# EAGLE design rfid (EAGLE 6.5.0)
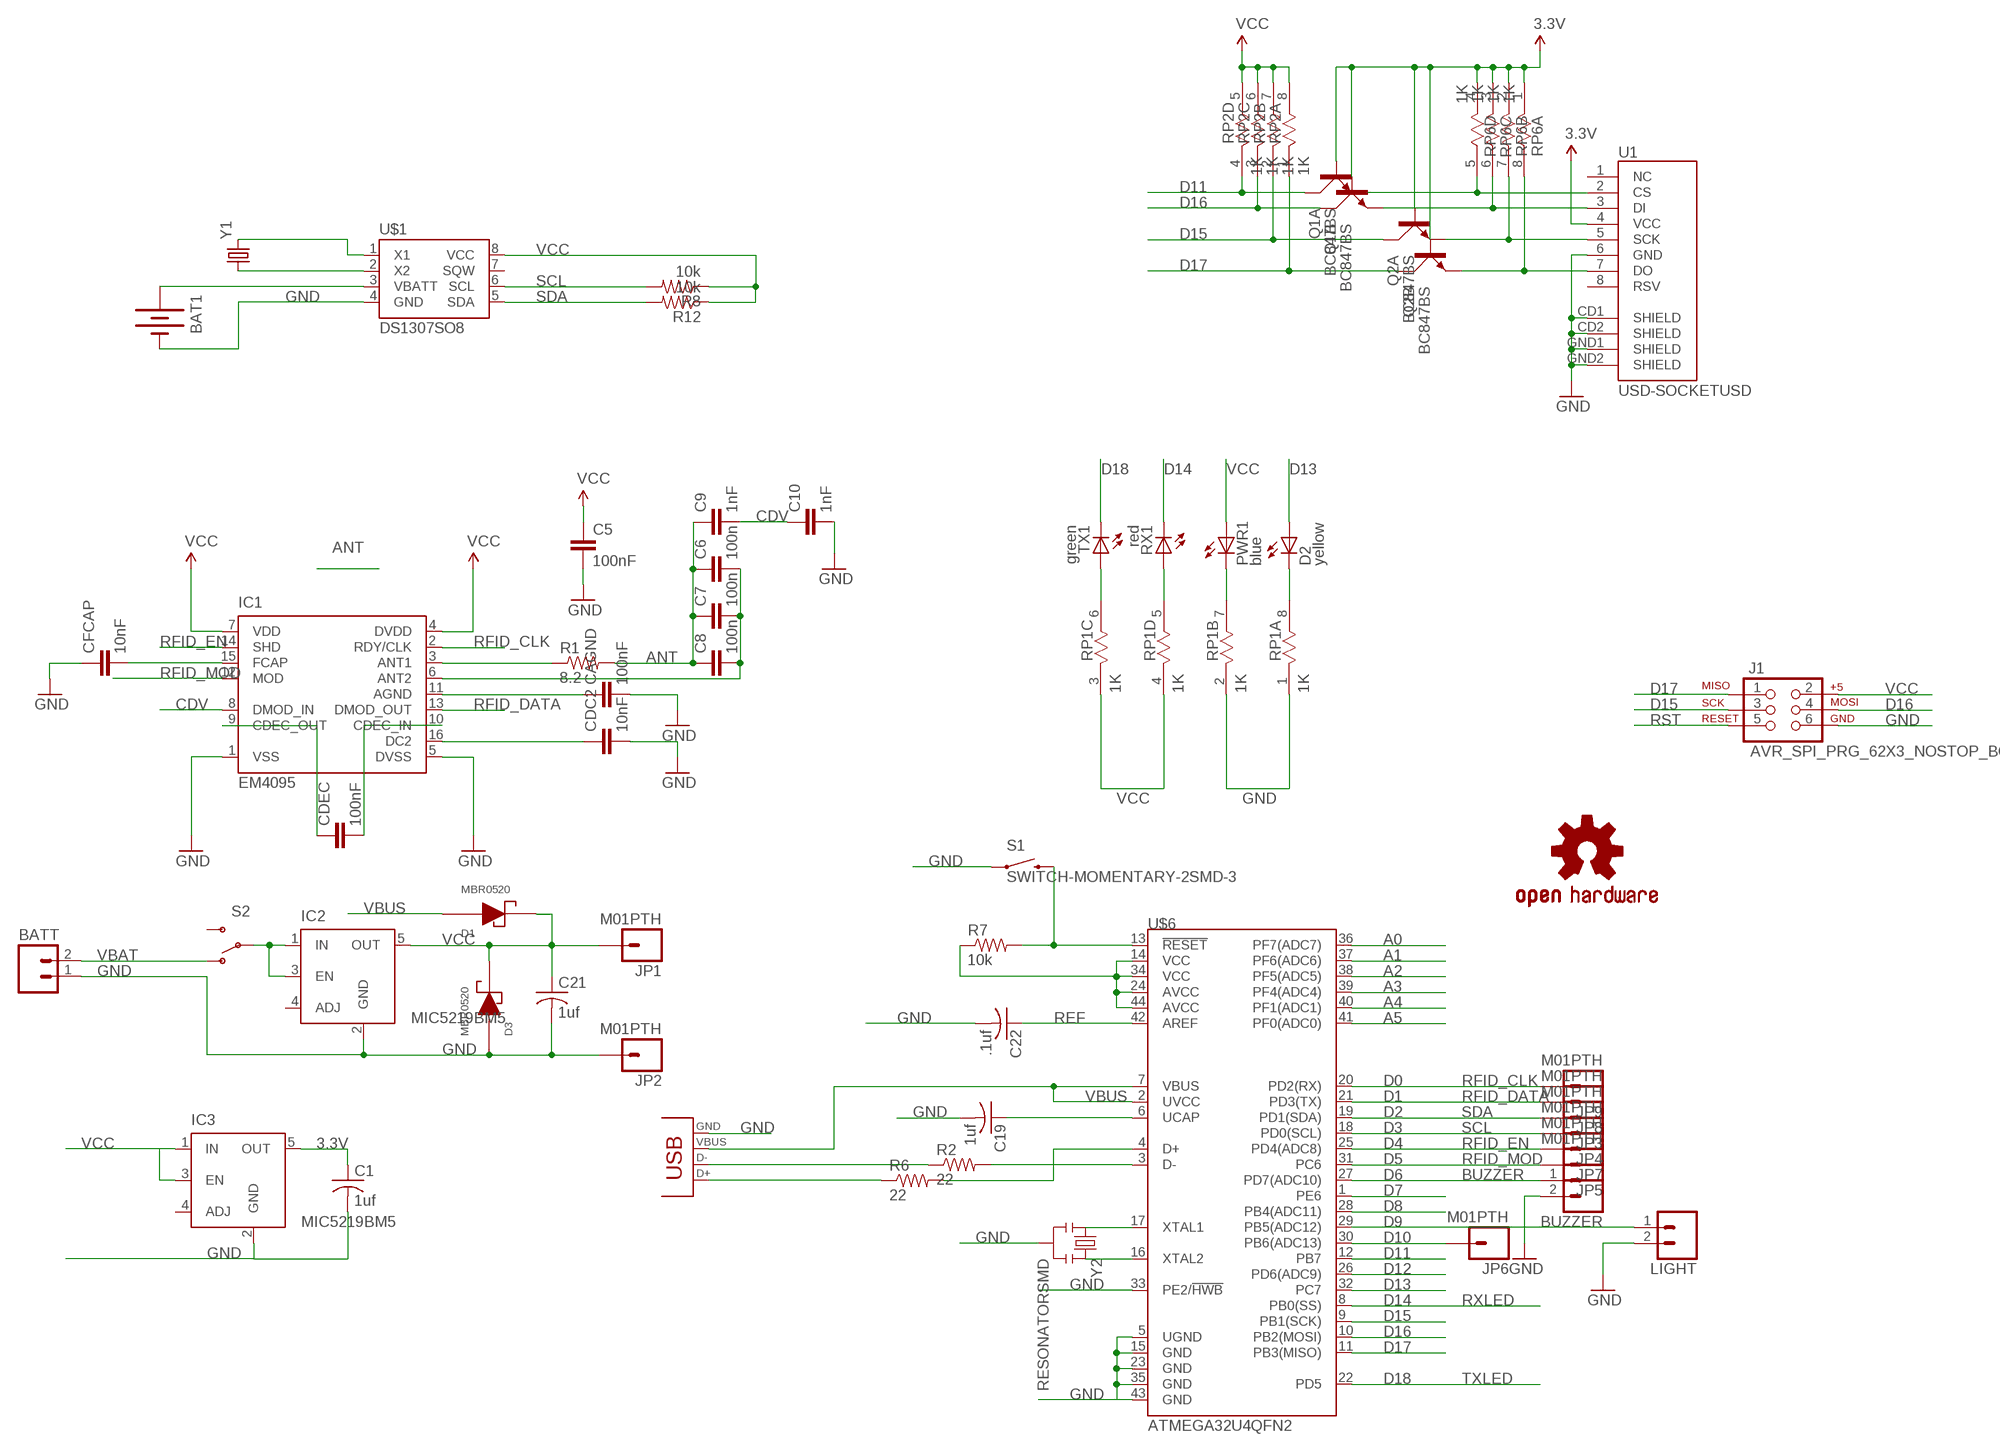
[diagram p0: schematic, sheet 1]

## Parts
BAT1  BATTERY12MM  [BATTCON_12MM]
BATT  M02PTH  [1X02]
BUZZER  M02PTH  [1X02]
C1  1uf  C-USC0603  [C0603]
C5  100nF  CAP0805  [0805]
C6  100n  CAP0805  [0805]
C7  100n  CAP0805  [0805]
C8  100n  CAP0805  [0805]
C9  1nF  CAP0805  [0805]
C10  1nF  CAP0805  [0805]
C19  1uf  C-USC0603  [C0603]
C21  1uf  C-USC0603  [C0603]
C22  .1uf  C-USC0603  [C0603]
CAGND  100nF  CAP0805  [0805]
CDC2  10nF  CAP0805  [0805]
CDEC  100nF  CAP0805  [0805]
CFCAP  10nF  CAP0805  [0805]
D1  MBR0520  [SOD-123]
D2  yellow  LED3MM  [LED3MM]
D3  MBR0520  [SOD-123]
IC1  EM4095  [SO16]
IC2  MIC5219BM5  [SOT23-5]
IC3  MIC5219BM5  [SOT23-5]
J1  AVR_SPI_PRG_62X3_NOSTOP_BOT  [2X3_STOP_BOT]
JP1  M01PTH  [1X01]
JP2  M01PTH  [1X01]
JP3  M01PTH  [1X01]
JP4  M01PTH  [1X01]
JP5  M01PTH  [1X01]
JP6  M01PTH  [1X01]
JP7  M01PTH  [1X01]
JP8  M01PTH  [1X01]
JP9  M01PTH  [1X01]
LIGHT  M02PTH  [1X02]
PWR1  blue  LED3MM  [LED3MM]
Q1  BC847BS  [SOT363_PHILIPS]
Q2  BC847BS  [SOT363_PHILIPS]
R1  8.2  RESISTOR0805-RES  [0805]
R2  22  RESISTOR0603-RES  [0603-RES]
R6  22  RESISTOR0603-RES  [0603-RES]
R7  10k  RESISTOR0603-RES  [0603-RES]
R8  10k  RESISTOR0603-RES  [0603-RES]
R12  10k  RESISTOR0603-RES  [0603-RES]
RP1  1K  RES4NT  [RES4NT]
RP2  1K  RES4NT  [RES4NT]
RP6  1K  RES4NT  [RES4NT]
RX1  red  LED3MM  [LED3MM]
S1  SWITCH-MOMENTARY-2SMD-3  [TACTILE_SWITCH_SMD-3]
S2  SWITCH-SPDT-SMD-A  [SWITCH-SPST-SMD-A]
TX1  green  LED3MM  [LED3MM]
U1  USD-SOCKETUSD  [USD-SOCKET-PP]
U$1  DS1307SO8  [SO08]
U$2  USB_MICROB  [USB-MICROB]
U$3  OSHW-LOGOL  [OSHW-LOGO-L]
U$6  ATMEGA32U4QFN2  [QFN-44-NOPAD]
Y1  CRYSTAL5X2  [CRYSTAL-SMD-5X2]
Y2  RESONATORSMD  [RESONATOR-SMD]

## Nets
3.3V: C1.1 IC3.5(OUT) Q1.2(A:B) Q1.5(B:B) Q2.2(A:B) Q2.5(B:B) RP6.1 RP6.2 RP6.3 RP6.4 U1.4(VCC)
A0: U$6.36(PF7(ADC7))
A1: U$6.37(PF6(ADC6))
A2: U$6.38(PF5(ADC5))
A3: U$6.39(PF4(ADC4))
A4: U$6.40(PF1(ADC1))
A5: U$6.41(PF0(ADC0))
ANT: C6.1 C7.1 C8.1 C9.1 R1.2
CDV: C9.2 C10.1 IC1.8(DMOD_IN)
D6: BUZZER.1 U$6.27(PD7(ADC10))
D7: U$6.1(PE6)
D8: U$6.28(PB4(ADC11))
D9: LIGHT.1 U$6.29(PB5(ADC12))
D10: JP6.1 U$6.30(PB6(ADC13))
D11: Q1.6(A:C) RP2.4 U$6.12(PB7)
D12: U$6.26(PD6(ADC9))
D13: D2.A U$6.32(PC7)
D14: RX1.K(C) U$6.8(PB0(SS))
D15: J1.3 Q2.6(A:C) RP2.2 U$6.9(PB1(SCK))
D16: J1.4 Q1.3(B:C) RP2.3 U$6.10(PB2(MOSI))
D17: J1.1 Q2.3(B:C) RP2.1 U$6.11(PB3(MISO))
D18: TX1.K(C) U$6.22(PD5)
GND: BAT1.GND(-) BATT.1 BUZZER.2 C1.2 C5.2 C10.2 C19.2 C21.2 C22.2 CAGND.2 CDC2.2 CFCAP.1 D3.2(AN) IC1.1(VSS) IC1.5(DVSS) IC2.2(GND) IC3.2(GND) J1.6 JP2.1 LIGHT.2 RP1.1 RP1.2 S1.P$1 U1.6(GND) U1.CD1(SHIELD) U1.CD2(SHIELD) U1.GND1(SHIELD) U1.GND2(SHIELD) U$1.4(GND) U$2.P4 U$2.P5 U$2.P$1 U$2.P$2 U$2.P$3 U$2.P$4 U$2.P$5 U$2.P$6 U$6.5(UGND) U$6.15(GND) U$6.23(GND) U$6.33(PE2/!HWB) U$6.35(GND) U$6.43(GND) Y2.2
N$1: IC1.3(ANT1) R1.1
N$2: IC2.1(IN) IC2.3(EN) S2.2(P)
N$3: U$6.16(XTAL2) Y2.3
N$4: C6.2 C7.2 C8.2 IC1.6(ANT2)
N$5: Q1.4(B:E) RP6.6 U1.3(DI)
N$6: CAGND.1 IC1.11(AGND)
N$7: CDEC.2 IC1.10(CDEC_IN)
N$8: CDEC.1 IC1.9(CDEC_OUT)
N$9: Q2.1(A:E) RP6.7 U1.5(SCK)
N$10: Q2.4(B:E) RP6.8 U1.7(DO)
N$12: CDC2.1 IC1.16(DC2)
N$15: CFCAP.2 IC1.15(FCAP)
N$17: U$1.1(X1) Y1.2
N$18: U$6.17(XTAL1) Y2.1
N$19: U$1.2(X2) Y1.1
N$20: BAT1.PWR@1(+) U$1.3(VBATT)
N$22: R6.2 U$6.4(D+)
N$23: R2.2 U$6.3(D-)
N$24: C19.1 U$6.6(UCAP)
N$25: R2.1 U$2.P2
N$26: R6.1 U$2.P3
N$28: RP1.6 TX1.A
N$29: RP1.5 RX1.A
N$30: PWR1.K(C) RP1.7
N$31: D2.K(C) RP1.8
N$163: Q1.1(A:E) RP6.5 U1.2(CS)
REF: C22.1 U$6.42(AREF)
RFID_CLK: IC1.2(RDY/CLK) JP9.1 U$6.20(PD2(RX))
RFID_DATA: IC1.13(DMOD_OUT) JP8.1 U$6.21(PD3(TX))
RFID_EN: IC1.14(SHD) JP7.1 U$6.25(PD4(ADC8))
RFID_MOD: IC1.12(MOD) JP5.1 U$6.31(PC6)
RST: J1.5 R7.2 S1.P$2 U$6.13(!RESET)
SCL: JP4.1 R8.2 U$1.6(SCL) U$6.18(PD0(SCL))
SDA: JP3.1 R12.2 U$1.5(SDA) U$6.19(PD1(SDA))
VBAT: BATT.2 S2.1(O)
VBUS: D1.2(AN) U$2.P1 U$6.2(UVCC) U$6.7(VBUS)
VCC: C5.1 C21.1 D1.1(CA) D3.1(CA) IC1.4(DVDD) IC1.7(VDD) IC2.5(OUT) IC3.1(IN) IC3.3(EN) J1.2 JP1.1 PWR1.A R7.1 R8.1 R12.1 RP1.3 RP1.4 RP2.5 RP2.6 RP2.7 RP2.8 U$1.8(VCC) U$6.14(VCC) U$6.24(AVCC) U$6.34(VCC) U$6.44(AVCC)
Unconnected: IC2.4(ADJ) IC3.4(ADJ) S2.3(S) U1.1(NC) U1.8(RSV) U$1.7(SQW)

## Notes on the sheet
- D0
- D1
- D2
- D3
- D4
- D5
- BUZZER
- RXLED
- TXLED

## Library data of the parts
BAT1 = SparkFun-Electromechanical:BATTERY: Battery Holders Various common sizes : AA, AAA, 20mm coin cell and 12mm coin cell.
BATT BUZZER LIGHT = SparkFun-Connectors:M02: Header 2 Standard 2-pin 0.1" header. Use with straight break away headers (SKU : PRT-00116), right angle break away headers (PRT-00553), swiss pins (PRT-00743), machine pins (PRT-00117), and female headers (PRT-00115). Molex polarized connector foot print use with SKU : PRT-08233 with associated crimp pins and housings.
C1 C19 C21 C22 = resistor:C-US: CAPACITOR, American symbol
C5-C10 CAGND CDC2 CDEC CFCAP = SparkFun-Passives:CAP: Capacitor Standard 0603 ceramic capacitor, and 0.1" leaded capacitor.
D1 D3 = MySMD:MBR0520
D2 PWR1 RX1 TX1 = led:LED: LED OSRAM: - CHIPLED LG R971, LG N971, LY N971, LG Q971, LY Q971, LO R971, LY R971 LH N974, LH R974 LS Q976, LO Q976, LY Q976 LO Q996 - Hyper CHIPLED LW Q18S LB Q993, LB Q99A, LB R99A - SideLED LS A670, LO A670, LY A670, LG A670, LP A670 LB A673, LV A673, LT A673, LW A673 LH A674 LY A675 LS A676, LA A676, LO A676, LY A676, LW A676 LS A679, LY A679, LG A679 - Hyper Micro SIDELED® LS Y876, LA Y876, LO Y876, LY Y876 LT Y87S - SmartLED LW L88C, LW L88S LB L89C, LB L89S, LG L890 LS L89K, LO L89K, LY L89K LS L896, LA L896, LO L896, LY L896 - TOPLED LS T670, LO T670, LY T670, LG T670, LP T670 LSG T670, LSP T670, LSY T670, LOP T670, LYG T670 LG T671, LOG T671, LSG T671 LB T673, LV T673, LT T673, LW T673 LH T674 LS T676, LA T676, LO T676, LY T676, LB T676, LH T676, LSB T676, LW T676 LB T67C, LV T67C, LT T67C, LS T67K, LO T67K, LY T67K, LW E67C LS E67B, LA E67B, LO E67B, LY E67B, LB E67C, LV E67C, LT E67C LW T67C LS T679, LY T679, LG T679 LS T770, LO T770, LY T770, LG T770, LP T770 LB T773, LV T773, LT T773, LW T773 LH T774 LS E675, LA E675, LY E675, LS T675 LS T776, LA T776, LO T776, LY T776, LB T776 LHGB T686 LT T68C, LB T68C - Hyper Mini TOPLED® LB M676 - Mini TOPLED Santana® LG M470 LS M47K, LO M47K, LY M47K Source: http://www.osram.convergy.de LUXEON: - LUMILED® LXK2-PW12-R00, LXK2-PW12-S00, LXK2-PW14-U00, LXK2-PW14-V00 LXK2-PM12-R00, LXK2-PM12-S00, LXK2-PM14-U00 LXK2-PE12-Q00, LXK2-PE12-R00, LXK2-PE12-S00, LXK2-PE14-T00, LXK2-PE14-U00 LXK2-PB12-K00, LXK2-PB12-L00, LXK2-PB12-M00, LXK2-PB14-N00, LXK2-PB14-P00, LXK2-PB14-Q00 LXK2-PR12-L00, LXK2-PR12-M00, LXK2-PR14-Q00, LXK2-PR14-R00 LXK2-PD12-Q00, LXK2-PD12-R00, LXK2-PD12-S00 LXK2-PH12-R00, LXK2-PH12-S00 LXK2-PL12-P00, LXK2-PL12-Q00, LXK2-PL12-R00 Source: www.luxeon.com KINGBRIGHT: KA-3528ASYC Source: www.kingbright.com
IC1 = em-microelectronic:EM4095: Read/Write analog front end for 125kHz RFID Basestation Source: http://www.emmicroelectronic.com/webfiles/Product/RFID/DS/EM4095_DS.pdf
IC2 IC3 = v-reg-micrel:MIC5219BM5: VOLTAGE REGULATOR; MF: ALTERA CORPORATION; MPN: MIC5219BM5 TR; OC_FARNELL: 1100656; OC_NEWARK: 09J8939
J1 = SparkFun-Connectors:AVR_SPI_PRG_6: AVR ISP 6 Pin This is the reduced ISP connector for AVR programming. Common on Arduino. This footprint will take up less PCB space and can be used with a 10-pin to 6-pin adapter such as SKU: BOB-08508
JP1-JP9 = SparkFun-Connectors:M01: Header 1 Standard 1-pin 0.1" header. Use with straight break away headers (SKU : PRT-00116), right angle break away headers (PRT-00553), swiss pins (PRT-00743), machine pins (PRT-00117), and female headers (PRT-00115).
Q1 Q2 = transistor-small-signal:BC847BS: NPN general purpose double transistor Source: http://www.farnell.com/datasheets/2466.pdf
R1 = SparkFun-Passives:RESISTOR: Resistor Basic schematic elements and footprints for 0603, 1206, and PTH resistors.
R2 R6-R8 R12 = SparkFun:RESISTOR: Resistor Basic schematic elements and footprints for 0603, 1206, and PTH resistors.
RP1 RP2 RP6 = MySMD:RES4NT
S1 = SparkFun:SWITCH-MOMENTARY-2
S2 = SparkFun-Electromechanical:SWITCH-SPDT: SPST Switch Simple slide switch. Spark Fun Electronics SKU : COM-00102
U1 = SparkFun:USD-SOCKET: microSD Socket Push-push type uSD socket. Schematic element and footprint production proven. Spark Fun Electronics SKU : PRT-00127. tDoc lines correctly indicate media card edge positions when inserting (unlocked, locked, depressed).
U$1 = SparkFun-FreqCtrl:DS1307: I2C real-time clock with battery backup.
U$2 = bakerk6:USB_MICROB
U$3 = SparkFun-Aesthetics:OSHW-LOGO: Open Source Hardware Logo This logo indicates the piece of hardware it is found on incorporates a OSHW license and/or adheres to the definition of open source hardware found here: http://freedomdefined.org/OSHW
U$6 = SparkFun-DigitalIC:ATMEGA32U4: Atmel 44-pin 8-bit Microcontroller with 32KBytes of ISP Flash and USB Controller
Y1 = SparkFun-FreqCtrl:CRYSTAL: Various standard crystals. Proven footprints. Spark Fun Electronics SKU : COM-00534
Y2 = SparkFun:RESONATOR: Resonator Small SMD resonator. This is the itty bitty 10/20MHz resonators with built in caps. CSTCE10M0G55 and CSTCE20M0V53. Footprint has been reviewed closely but hasn't been tested yet.

## Board
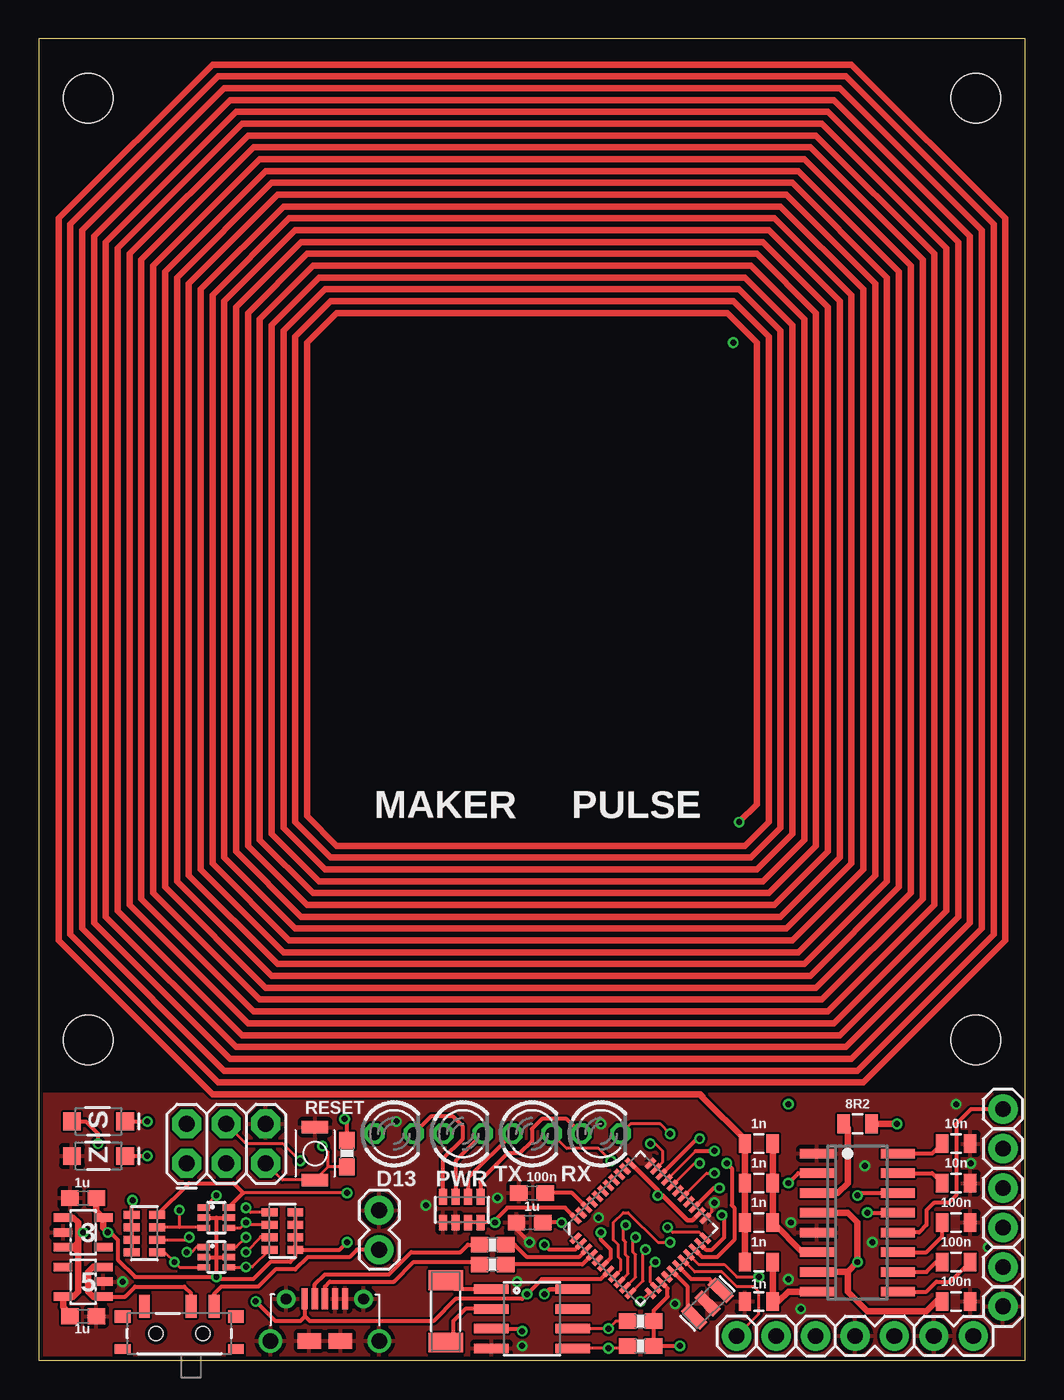
[diagram p1: board, top side]
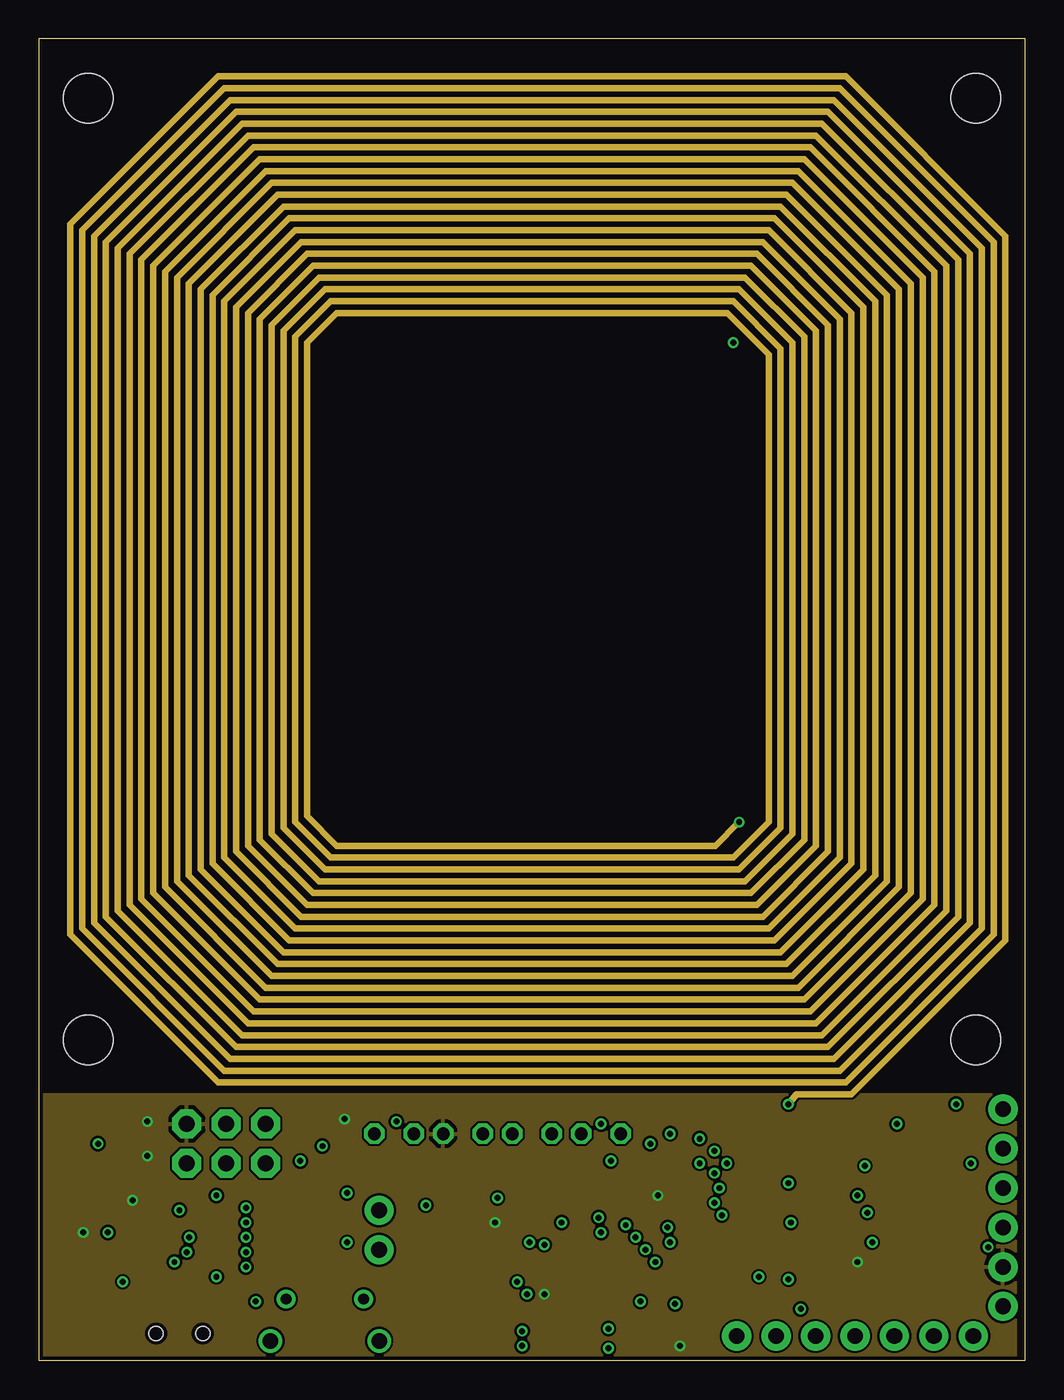
[diagram p2: board, inner layer Route2]
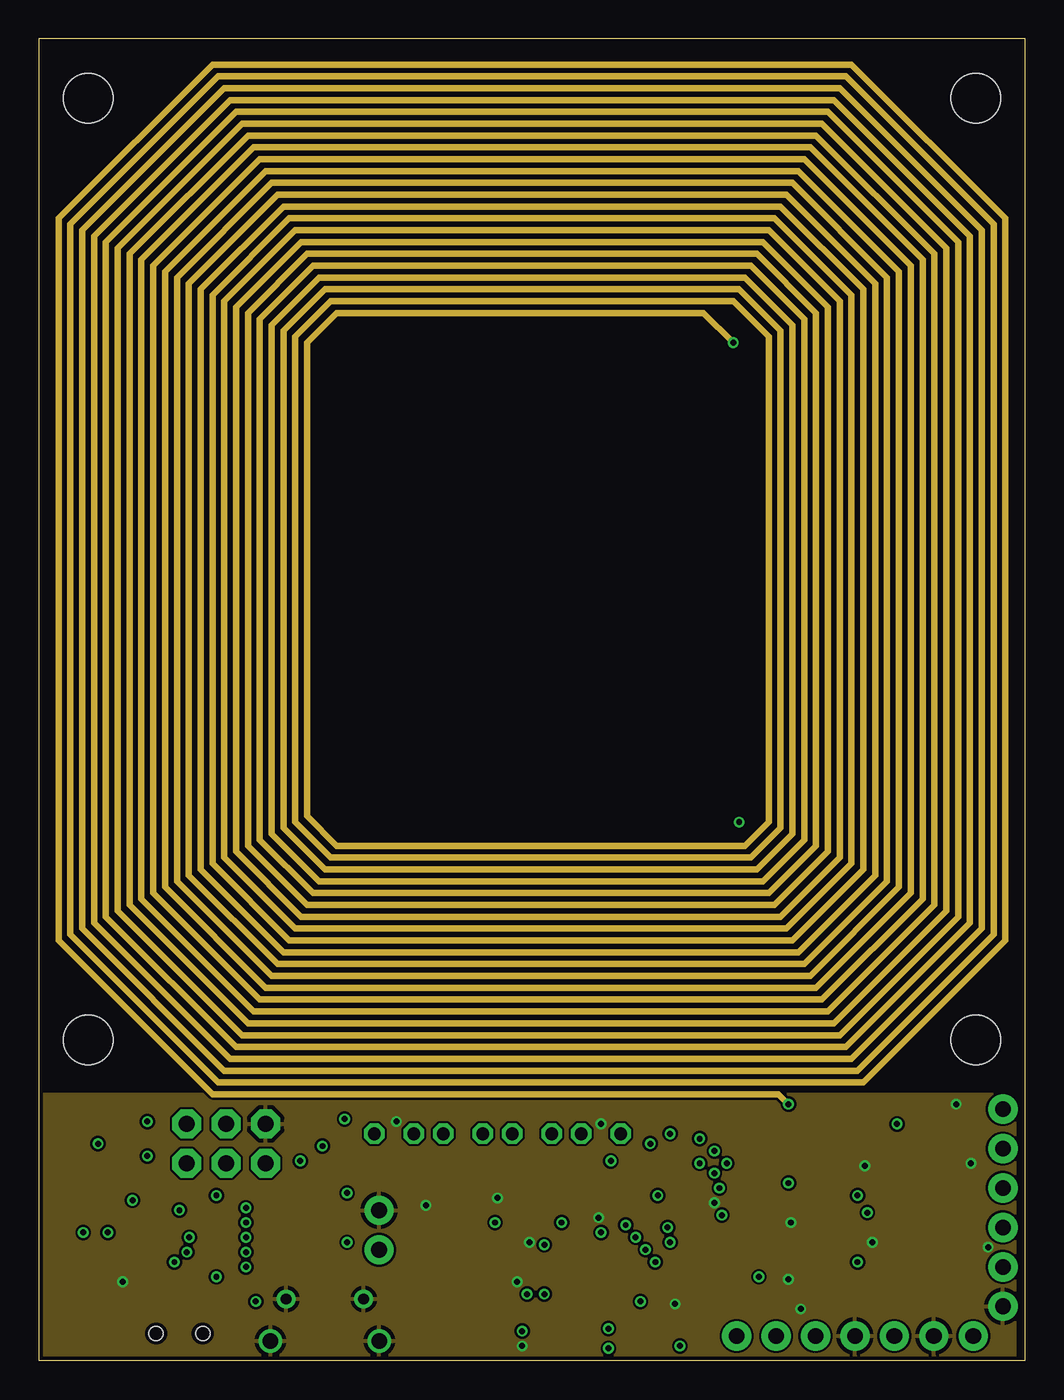
[diagram p3: board, inner layer Route15]
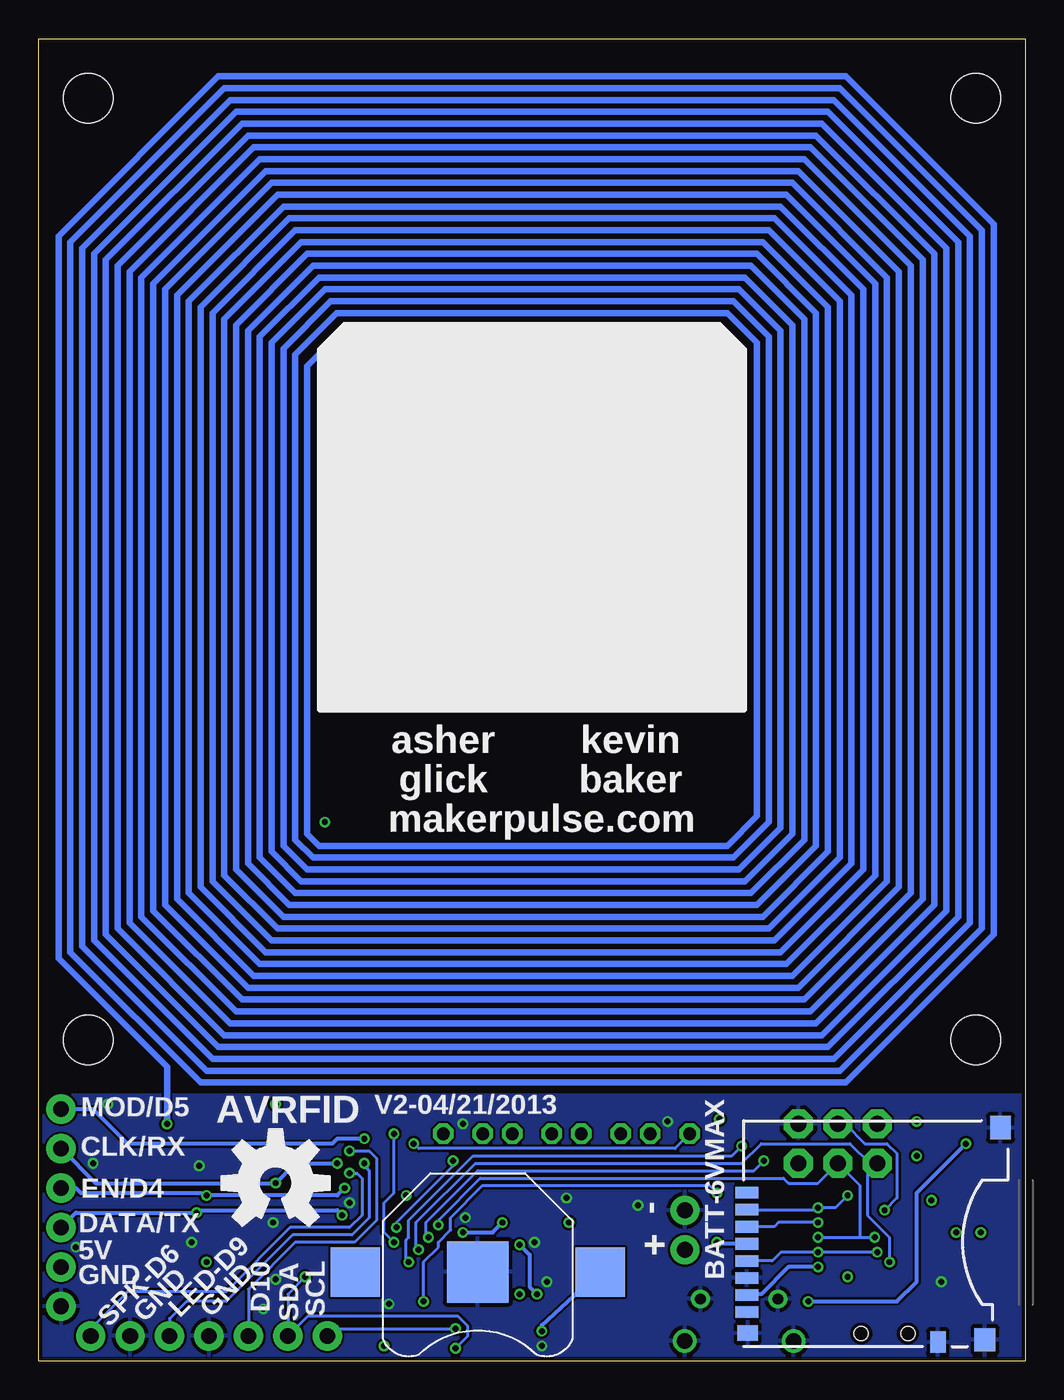
[diagram p4: board, bottom side, seen from below]

Size 63.5 x 85.09 mm. Coordinates in mm from the lower left corner, seen from the top.
Outline: 63.5,85.09 0,85.09 0,0 63.5,0 63.5,85.09
Copper layers (1*2*15*16): Top 0.035mm / dielectric 1.5mm / Route2 0.035mm / dielectric 0.15mm / Route15 0.035mm / dielectric 0.2mm / Bottom 0.035mm
Design rules "default": minimum track width 6mil, minimum drill 12mil, track to track 6mil, track to pad 6mil, pad to pad 6mil, via to via 6mil, smd to smd 0mil, copper to edge 10mil, drill to drill 10mil, minimum pad ring 10mil, minimum via ring 6mil, stop-mask expansion 2mil, vias tented up to drill 100mil, thermal gap 10mil
Holes 3.17 mm at 3.17,81.28 60.33,81.28 60.33,20.64 3.17,20.64

### Footprints (pad centres in the part's own frame; a part is rotated, then mirrored left to right if it is on the bottom)
BATTCON_12MM = smd 3.962 x 3.962: GND 0,0 | smd 3.175 x 3.175: PWR@1 -7.874,0; PWR@2 7.874,0
1X02 = drill 1.016 pad 1.88: 1 0,0; 2 2.54,0
C0603 = smd 1.1 x 1: 1 -0.85,0; 2 0.85,0
0805 = smd 0.8 x 1.2: 1 -0.9,0; 2 0.9,0
SOD-123 = smd 1.143 x 1.143: 1 0,0; 2 3.429,0
LED3MM = drill 0.813 octagon: A -1.27,0; K 1.27,0
SO16 = smd 0.6 x 2.2: 1 -4.445,-2.6; 2 -3.175,-2.6; 3 -1.905,-2.6; 4 -0.635,-2.6; 5 0.635,-2.6; 6 1.905,-2.6; 7 3.175,-2.6; 8 4.445,-2.6; 9 4.445,2.6; 10 3.175,2.6; 11 1.905,2.6; 12 0.635,2.6; 13 -0.635,2.6; 14 -1.905,2.6; 15 -3.175,2.6; 16 -4.445,2.6
SOT23-5 = smd 0.55 x 1.2: 1 -0.95,-1.3; 2 0,-1.3; 3 0.95,-1.3; 4 0.95,1.3; 5 -0.95,1.3
2X3_STOP_BOT = drill 1.016 pad 1.88 octagon: 1 -2.54,-1.27; 2 -2.54,1.27; 3 0,-1.27; 4 0,1.27; 5 2.54,-1.27; 6 2.54,1.27
1X01 = drill 1.016 pad 1.88: 1 0,0
SOT363_PHILIPS = smd 0.4 x 0.8: 1 -0.65,-0.8; 2 0,-0.8; 3 0.65,-0.8; 4 0.65,0.8; 5 0,0.8; 6 -0.65,0.8
0603-RES = smd 1.1 x 1: 1 -0.85,0; 2 0.85,0
RES4NT = smd 0.508 x 1.016: 1 0,0; 2 0.8,0; 3 1.6,0; 4 2.4,0; 5 2.4,1.651; 6 1.6,1.651; 7 0.8,1.651; 8 0,1.651
TACTILE_SWITCH_SMD-3 = smd 0.8 x 1.7: P$1 -1.7,0; P$2 1.7,0
SWITCH-SPST-SMD-A = smd 0.7 x 1.5: 1 -2.25,-1.75; 2 -0.75,-1.75; 3 2.25,-1.75 | smd 1 x 0.6: GND1 -3.65,1; GND3 3.65,1 | smd 1 x 0.8: GND2 -3.65,-1.1; GND4 3.65,-1.1 | hole 0.9: -1.5,0; 1.5,0
USD-SOCKET-PP = smd 0.75 x 1.5: 1 3.2,16.8; 2 2.1,16.8; 3 1,16.8; 4 -0.1,16.8; 5 -1.2,16.8; 6 -2.3,16.8; 7 -3.4,16.8; 8 -4.5,16.8 | smd 1 x 1.3: CD1 -5.85,16.75 | smd 1.4 x 1: CD2 -6.425,4.5 | smd 1.5 x 1.35: GND1 -6.275,1.475; GND2 7.375,0.475
SO08 = smd 0.61 x 2.21: 1 -1.905,-2.616; 2 -0.635,-2.616; 3 0.635,-2.616; 4 1.905,-2.616; 5 1.905,2.616; 6 0.635,2.616; 7 -0.635,2.616; 8 -1.905,2.616
USB-MICROB = smd 0.4 x 1.35: P1 -1.3,2.7; P2 -0.65,2.7; P3 0,2.7; P4 0.65,2.7; P5 1.3,2.7 | drill 1: P$1 -3.5,0; P$2 3.5,0 | drill 0.7: P$3 -2.5,2.7; P$4 2.5,2.7 | smd 1.5 x 1: P$5 -1,0; P$6 1,0
QFN-44-NOPAD = smd 0.8 x 0.3: 1 -3.4,2.5; 2 -3.4,2; 3 -3.4,1.5; 4 -3.4,1; 5 -3.4,0.5; 6 -3.4,0; 7 -3.4,-0.5; 8 -3.4,-1; 9 -3.4,-1.5; 10 -3.4,-2; 11 -3.4,-2.5; 23 3.4,-2.5; 24 3.4,-2; 25 3.4,-1.5; 26 3.4,-1; 27 3.4,-0.5; 28 3.4,0; 29 3.4,0.5; 30 3.4,1; 31 3.4,1.5; 32 3.4,2; 33 3.4,2.5 | smd 0.3 x 0.8: 12 -2.5,-3.4; 13 -2,-3.4; 14 -1.5,-3.4; 15 -1,-3.4; 16 -0.5,-3.4; 17 0,-3.4; 18 0.5,-3.4; 19 1,-3.4; 20 1.5,-3.4; 21 2,-3.4; 22 2.5,-3.4; 34 2.5,3.4; 35 2,3.4; 36 1.5,3.4; 37 1,3.4; 38 0.5,3.4; 39 0,3.4; 40 -0.5,3.4; 41 -1,3.4; 42 -1.5,3.4; 43 -2,3.4; 44 -2.5,3.4
CRYSTAL-SMD-5X2 = smd 1.27 x 2.21: 1 -2,0; 2 2,0
RESONATOR-SMD = smd 0.7 x 1.7: 1 -1.2,0; 2 0,0; 3 1.2,0

### Placement (x,y rotation side)
BAT1  35.24,5.71 180 bottom
BATT  21.91,9.68 270 top
BUZZER  60.17,1.59 180 top
C1  2.86,10.48 180 top
C5  59.05,3.81 0 top
C6  46.35,13.97 0 top
C7  46.35,11.43 0 top
C8  46.35,8.89 0 top
C9  46.35,6.35 0 top
C10  46.35,3.81 180 top
C19  31.59,8.89 180 top
C21  2.86,2.86 0 top
C22  31.75,10.79 180 top
CAGND  59.05,8.89 0 top
CDC2  59.05,13.97 0 top
CDEC  59.05,6.35 180 top
CFCAP  59.05,11.43 180 top
D1  5.56,15.4 180 top
D2  22.86,14.61 0 top
D3  5.56,13.18 180 top
IC1  52.7,8.89 270 top
IC2  2.86,5.08 90 top
IC3  2.86,8.26 270 top
J1  12.06,13.97 0 top
JP1  62.07,6.03 0 top
JP2  62.07,3.49 0 top
JP3  47.47,1.59 0 top
JP4  44.93,1.59 0 top
JP5  62.07,16.19 0 top
JP6  50.01,1.59 0 top
JP7  62.07,11.11 0 top
JP8  62.07,8.57 0 top
JP9  62.07,13.65 0 top
LIGHT  55.09,1.59 180 top
PWR1  27.3,14.61 0 top
Q1  11.43,9.21 270 top
Q2  11.43,6.67 270 top
R1  52.7,15.24 0 top
R2  29.21,7.46 0 top
R6  29.21,6.19 0 top
R7  19.84,13.34 270 top
R8  38.73,2.54 180 top
R12  38.73,0.95 180 top
RP1  26.04,8.89 0 top
RP2  7.62,6.99 90 top
RP6  16.51,7.14 90 top
RX1  36.2,14.61 0 top
S1  17.78,13.34 270 top
S2  9.05,1.75 180 top
TX1  31.75,14.61 0 top
U1  1.11,7.62 90 bottom
U$1  31.75,2.7 270 top
U$2  18.41,1.27 0 top
U$3  48.26,11.43 0 bottom
U$6  38.73,8.52 45 top
Y1  26.19,3.17 90 top
Y2  43.05,3.68 225 top

### Tracks (layer width: path | path; a pad name or v marks a point on that pad's centre or on a via)
3.3V  (via drill 0.38)
  Top 0.254: Q1.5 Q1.2 11.43,9.21 11.43,6.67 | Q2.2 11.43,6.67 | 11.43,6.67 Q2.5 | 11.43,6.67 v11.43,5.4 | v19.84,7.62 19.37,7.14 RP6.1 RP6.2 RP6.3 RP6.4 16.51,6.67 16.19,6.35 14.92,6.35 13.81,5.24 11.59,5.24 v11.43,5.4 | v4.45,8.26 4.6,8.26 5.08,7.78 5.08,6.51 6.19,5.4 v11.43,5.4
  Top 0.406: C1.1 3.71,9.65 IC3.5 4.16,8.54 v4.45,8.26
  Bottom 0.254: U1.4 19.63,7.52 v19.84,7.62
ANT  (via drill 0.38)
  Top 0.406: v45.09,34.67 46.23,35.81 46.23,65.53 44.32,67.44 19.18,67.44 17.27,65.53 17.27,35.05 19.18,33.15 45.47,33.15 46.99,34.67 46.99,65.91 44.7,68.2 18.8,68.2 16.51,65.91 16.51,34.67 18.8,32.38 45.85,32.38 47.75,34.29 47.75,66.29 45.09,68.96 18.41,68.96 15.75,66.29 15.75,34.29 18.41,31.62 46.23,31.62 48.51,33.91 48.51,66.67 45.47,69.72 18.03,69.72 14.99,66.67 14.99,33.91 18.03,30.86 46.61,30.86 49.28,33.53 49.28,67.06 45.85,70.48 17.65,70.48 14.22,67.06 14.22,33.53 17.65,30.1 46.99,30.1 50.04,33.15 50.04,67.44 46.23,71.25 17.27,71.25 13.46,67.44 13.46,33.15 17.27,29.34 47.37,29.34 50.8,32.77 50.8,67.82 46.61,72.01 16.89,72.01 12.7,67.82 12.7,32.77 16.89,28.57 47.75,28.57 51.56,32.38 51.56,68.2 46.99,72.77 16.51,72.77 11.94,68.2 11.94,32.38 16.51,27.81 48.13,27.81 52.32,32 52.32,68.58 47.37,73.53 16.13,73.53 11.18,68.58 11.18,32 16.13,27.05 48.51,27.05 53.09,31.62 53.09,68.96 47.75,74.3 15.75,74.3 10.41,68.96 10.41,31.62 15.75,26.29 48.9,26.29 53.85,31.24 53.85,69.34 48.13,75.06 15.37,75.06 9.65,69.34 9.65,31.24 15.37,25.53 49.28,25.53 54.61,30.86 54.61,69.72 48.51,75.82 14.99,75.82 8.89,69.72 8.89,30.86 14.99,24.77 49.66,24.77 55.37,30.48 55.37,70.1 48.9,76.58 14.61,76.58 8.13,70.1 8.13,30.48 14.61,24 50.04,24 56.13,30.1 56.13,70.48 49.28,77.34 14.22,77.34 7.37,70.48 7.37,30.1 14.22,23.24 50.42,23.24 56.9,29.72 56.9,70.87 49.66,78.11 13.84,78.11 6.6,70.87 6.6,29.72 13.84,22.48 50.8,22.48 57.66,29.34 57.66,71.25 50.04,78.87 13.46,78.87 5.84,71.25 5.84,29.34 13.46,21.72 51.18,21.72 58.42,28.96 58.42,71.63 50.42,79.63 13.08,79.63 5.08,71.63 5.08,28.96 13.08,20.95 51.56,20.95 59.18,28.57 59.18,72.01 50.8,80.39 12.7,80.39 4.32,72.01 4.32,28.57 12.7,20.19 51.94,20.19 59.94,28.19 59.94,72.39 51.18,81.15 12.32,81.15 3.56,72.39 3.56,28.19 12.32,19.43 52.32,19.43 60.71,27.81 60.71,72.77 51.56,81.92 11.94,81.92 2.79,72.77 2.79,27.81 11.94,18.67 52.7,18.67 61.47,27.43 61.47,73.15 51.94,82.68 11.56,82.68 2.03,73.15 2.03,27.43 11.56,17.91 53.09,17.91 62.23,27.05 62.23,73.53 52.32,83.44 11.18,83.44 1.27,73.53 1.27,27.05 11.18,17.14 42.61,17.14 42.74,17.02 42.67,17.02 45.58,14.11 45.59,14.11 C6.1 C7.1 C8.1 C9.1
  Top 0.406: R1.2 v55.24,15.24
  Route2 0.406: v45.09,34.67 43.56,33.15 19.18,33.15 17.27,35.05 17.27,65.53 19.18,67.44 44.32,67.44 46.99,64.77 46.99,34.67 44.7,32.38 18.8,32.38 16.51,34.67 16.51,65.91 18.8,68.2 44.7,68.2 47.75,65.15 47.75,34.29 45.09,31.62 18.41,31.62 15.75,34.29 15.75,66.29 18.41,68.96 45.09,68.96 48.51,65.53 48.51,33.91 45.47,30.86 18.03,30.86 14.99,33.91 14.99,66.67 18.03,69.72 45.47,69.72 49.28,65.91 49.28,33.53 45.85,30.1 17.65,30.1 14.22,33.53 14.22,67.06 17.65,70.48 45.85,70.48 50.04,66.29 50.04,33.15 46.23,29.34 17.27,29.34 13.46,33.15 13.46,67.44 17.27,71.25 46.23,71.25 50.8,66.67 50.8,32.77 46.61,28.57 16.89,28.57 12.7,32.77 12.7,67.82 16.89,72.01 46.61,72.01 51.56,67.06 51.56,32.38 46.99,27.81 16.51,27.81 11.94,32.38 11.94,68.2 16.51,72.77 46.99,72.77 52.32,67.44 52.32,32 47.37,27.05 16.13,27.05 11.18,32 11.18,68.58 16.13,73.53 47.37,73.53 53.09,67.82 53.09,31.62 47.75,26.29 15.75,26.29 10.41,31.62 10.41,68.96 15.75,74.3 47.75,74.3 53.85,68.2 53.85,31.24 48.13,25.53 15.37,25.53 9.65,31.24 9.65,69.34 15.37,75.06 48.13,75.06 54.61,68.58 54.61,30.86 48.51,24.77 14.99,24.77 8.89,30.86 8.89,69.72 14.99,75.82 48.51,75.82 55.37,68.96 55.37,30.48 48.9,24 14.61,24 8.13,30.48 8.13,70.1 14.61,76.58 48.9,76.58 56.13,69.34 56.13,30.1 49.28,23.24 14.22,23.24 7.37,30.1 7.37,70.48 14.22,77.34 49.28,77.34 56.9,69.72 56.9,29.72 49.66,22.48 13.84,22.48 6.6,29.72 6.6,70.87 13.84,78.11 49.66,78.11 57.66,70.1 57.66,29.34 50.04,21.72 13.46,21.72 5.84,29.34 5.84,71.25 13.46,78.87 50.04,78.87 58.42,70.48 58.42,28.96 50.42,20.95 13.08,20.95 5.08,28.96 5.08,71.63 13.08,79.63 50.42,79.63 59.18,70.87 59.18,28.57 50.8,20.19 12.7,20.19 4.32,28.57 4.32,72.01 12.7,80.39 50.8,80.39 59.94,71.25 59.94,28.19 51.18,19.43 12.32,19.43 3.56,28.19 3.56,72.39 12.32,81.15 51.18,81.15 60.71,71.63 60.71,27.81 51.56,18.67 11.94,18.67 2.79,27.81 2.79,72.77 11.94,81.92 51.56,81.92 61.47,72.01 61.47,27.43 51.94,17.91 11.56,17.91 2.03,27.43 2.03,73.15 11.56,82.68 51.94,82.68 62.23,72.39 62.23,27.05 52.32,17.14 48.77,17.14 v48.26,16.51
  Route15 0.406: v44.7,65.53 42.8,67.44 19.18,67.44 17.27,65.53 17.27,35.05 19.18,33.15 45.47,33.15 46.99,34.67 46.99,65.91 44.7,68.2 18.8,68.2 16.51,65.91 16.51,34.67 18.8,32.38 45.85,32.38 47.75,34.29 47.75,66.29 45.09,68.96 18.41,68.96 15.75,66.29 15.75,34.29 18.41,31.62 46.23,31.62 48.51,33.91 48.51,66.67 45.47,69.72 18.03,69.72 14.99,66.67 14.99,33.91 18.03,30.86 46.61,30.86 49.28,33.53 49.28,67.06 45.85,70.48 17.65,70.48 14.22,67.06 14.22,33.53 17.65,30.1 46.99,30.1 50.04,33.15 50.04,67.44 46.23,71.25 17.27,71.25 13.46,67.44 13.46,33.15 17.27,29.34 47.37,29.34 50.8,32.77 50.8,67.82 46.61,72.01 16.89,72.01 12.7,67.82 12.7,32.77 16.89,28.57 47.75,28.57 51.56,32.38 51.56,68.2 46.99,72.77 16.51,72.77 11.94,68.2 11.94,32.38 16.51,27.81 48.13,27.81 52.32,32 52.32,68.58 47.37,73.53 16.13,73.53 11.18,68.58 11.18,32 16.13,27.05 48.51,27.05 53.09,31.62 53.09,68.96 47.75,74.3 15.75,74.3 10.41,68.96 10.41,31.62 15.75,26.29 48.9,26.29 53.85,31.24 53.85,69.34 48.13,75.06 15.37,75.06 9.65,69.34 9.65,31.24 15.37,25.53 49.28,25.53 54.61,30.86 54.61,69.72 48.51,75.82 14.99,75.82 8.89,69.72 8.89,30.86 14.99,24.77 49.66,24.77 55.37,30.48 55.37,70.1 48.9,76.58 14.61,76.58 8.13,70.1 8.13,30.48 14.61,24 50.04,24 56.13,30.1 56.13,70.48 49.28,77.34 14.22,77.34 7.37,70.48 7.37,30.1 14.22,23.24 50.42,23.24 56.9,29.72 56.9,70.87 49.66,78.11 13.84,78.11 6.6,70.87 6.6,29.72 13.84,22.48 50.8,22.48 57.66,29.34 57.66,71.25 50.04,78.87 13.46,78.87 5.84,71.25 5.84,29.34 13.46,21.72 51.18,21.72 58.42,28.96 58.42,71.63 50.42,79.63 13.08,79.63 5.08,71.63 5.08,28.96 13.08,20.95 51.56,20.95 59.18,28.57 59.18,72.01 50.8,80.39 12.7,80.39 4.32,72.01 4.32,28.57 12.7,20.19 51.94,20.19 59.94,28.19 59.94,72.39 51.18,81.15 12.32,81.15 3.56,72.39 3.56,28.19 12.32,19.43 52.32,19.43 60.71,27.81 60.71,72.77 51.56,81.92 11.94,81.92 2.79,72.77 2.79,27.81 11.94,18.67 52.7,18.67 61.47,27.43 61.47,73.15 51.94,82.68 11.56,82.68 2.03,73.15 2.03,27.43 11.56,17.91 53.09,17.91 62.23,27.05 62.23,73.53 52.32,83.44 11.18,83.44 1.27,73.53 1.27,27.05 11.18,17.14 47.62,17.14 v48.26,16.51
  Bottom 0.406: v44.7,65.53 46.23,64.01 46.23,33.91 45.47,33.15 19.18,33.15 17.27,35.05 17.27,65.53 19.18,67.44 44.32,67.44 46.99,64.77 46.99,33.53 45.85,32.38 18.8,32.38 16.51,34.67 16.51,65.91 18.8,68.2 44.7,68.2 47.75,65.15 47.75,33.15 46.23,31.62 18.41,31.62 15.75,34.29 15.75,66.29 18.41,68.96 45.09,68.96 48.51,65.53 48.51,32.77 46.61,30.86 18.03,30.86 14.99,33.91 14.99,66.67 18.03,69.72 45.47,69.72 49.28,65.91 49.28,32.38 46.99,30.1 17.65,30.1 14.22,33.53 14.22,67.06 17.65,70.48 45.85,70.48 50.04,66.29 50.04,32 47.37,29.34 17.27,29.34 13.46,33.15 13.46,67.44 17.27,71.25 46.23,71.25 50.8,66.67 50.8,31.62 47.75,28.57 16.89,28.57 12.7,32.77 12.7,67.82 16.89,72.01 46.61,72.01 51.56,67.06 51.56,31.24 48.13,27.81 16.51,27.81 11.94,32.38 11.94,68.2 16.51,72.77 46.99,72.77 52.32,67.44 52.32,30.86 48.51,27.05 16.13,27.05 11.18,32 11.18,68.58 16.13,73.53 47.37,73.53 53.09,67.82 53.09,30.48 48.9,26.29 15.75,26.29 10.41,31.62 10.41,68.96 15.75,74.3 47.75,74.3 53.85,68.2 53.85,30.1 49.28,25.53 15.37,25.53 9.65,31.24 9.65,69.34 15.37,75.06 48.13,75.06 54.61,68.58 54.61,29.72 49.66,24.77 14.99,24.77 8.89,30.86 8.89,69.72 14.99,75.82 48.51,75.82 55.37,68.96 55.37,29.34 50.04,24 14.61,24 8.13,30.48 8.13,70.1 14.61,76.58 48.9,76.58 56.13,69.34 56.13,28.96 50.42,23.24 14.22,23.24 7.37,30.1 7.37,70.48 14.22,77.34 49.28,77.34 56.9,69.72 56.9,28.57 50.8,22.48 13.84,22.48 6.6,29.72 6.6,70.87 13.84,78.11 49.66,78.11 57.66,70.1 57.66,28.19 51.18,21.72 13.46,21.72 5.84,29.34 5.84,71.25 13.46,78.87 50.04,78.87 58.42,70.48 58.42,27.81 51.56,20.95 13.08,20.95 5.08,28.96 5.08,71.63 13.08,79.63 50.42,79.63 59.18,70.87 59.18,27.43 51.94,20.19 12.7,20.19 4.32,28.57 4.32,72.01 12.7,80.39 50.8,80.39 59.94,71.25 59.94,27.05 52.32,19.43 12.32,19.43 3.56,28.19 3.56,72.39 12.32,81.15 51.18,81.15 60.71,71.63 60.71,26.67 52.7,18.67 11.94,18.67 2.79,27.81 2.79,72.77 11.94,81.92 51.56,81.92 61.47,72.01 61.47,26.29 53.09,17.91 11.56,17.91 2.03,27.43 2.03,73.15 11.56,82.68 51.94,82.68 62.23,72.39 62.23,25.91 55.24,18.92 v55.24,15.24
CDV
  Top 0.406: 47.38,3.94 C10.1 | C9.2 C10.1 | IC1.8 48.26,4.45 47.62,3.81 C10.1
D6  (via drill 0.38)
  Top 0.203: U$6.27 42.99,12.06 v43.5,12.06
  Bottom 0.203: v43.5,12.06 43.02,12.06 42.7,11.75 42.7,9.37 43.5,8.57 47.31,8.57 51.44,4.45 57.78,4.45 60.17,2.06 BUZZER.1
D9  (via drill 0.38)
  Top 0.203: U$6.29 42.21,12.7 v42.55,12.7
  Bottom 0.203: v42.55,12.7 42.23,12.22 42.23,9.21 43.34,8.1 47.15,8.1 51.44,3.81 53.98,3.81 55.09,2.7 LIGHT.1
D10  (via drill 0.38)
  Top 0.203: U$6.30 42.3,13.49
  Top 0.254: 42.3,13.49 v43.5,13.49
  Bottom 0.203: v43.5,13.49 42.23,13.49 41.75,13.02 41.75,9.05 43.18,7.62 46.99,7.62 50.01,4.6 JP6.1
D11  (via drill 0.38)
  Top 0.203: 39.27,4.35 v38.73,3.81 | v19.84,10.79 13.17,10.79
  Top 0.254: U$6.12 39.27,4.35 | Q1.6 13.17,10.79 13.17,10.8 12.54,11.43 9.66,11.43 RP2.4
  Bottom 0.203: v38.73,3.81 38.73,6.35 37.78,7.3 37.78,7.62 36.99,8.41 36.99,9.21 34.92,11.27 20.32,11.27 v19.84,10.79
D13  (via drill 0.38)
  Top 0.203: v39.37,13.97 39.69,13.97 40.16,13.49 40.16,12.78 U$6.32
  Bottom 0.203: D2.A 22.54,13.65 39.05,13.65 v39.37,13.97
D14  (via drill 0.38)
  Top 0.203: U$6.8 37.47,5.83 37.47,6.51 37.31,6.67 37.31,7.46 36.99,7.78 36.99,8.89 37.62,9.53 37.94,9.53 39.85,7.62 v40.64,7.62 | v40.64,14.61 40.01,15.24 38.1,15.24 RX1.K
  Bottom 0.203: v40.64,7.62 41.27,8.26 41.27,10.16 40.64,10.79 v40.64,14.61
D15  (via drill 0.38)
  Top 0.203: U$6.9 37.94,5.6 37.94,6.67 37.78,6.83 37.78,7.62 37.62,7.78 37.62,8.57 v37.78,8.73 | Q2.6 12.71,7.32 v13.34,7.94 | RP2.2 9.53,7.79 v9.68,7.94
  Bottom 0.203: v37.78,8.73 37.78,9.05 35.08,11.75 15.56,11.75 15.24,11.43 13.34,11.43 J1.3 10.64,11.27 10.64,7.94 | v13.34,7.94 10.64,7.94 | 10.64,7.94 v9.68,7.94
  Bottom 0.254: 9.84,7.94 v9.68,7.94
D16  (via drill 0.38)
  Top 0.203: U$6.10 38.42,5.37 38.42,6.83 38.26,6.99 38.26,7.78 v38.42,7.94 | v16.83,12.86 15.72,13.97 13.34,13.97 J1.4 | v9.05,9.68 9.05,8.57 9.04,8.59 | Q1.3 10.6,8.59 9.04,8.59 | 9.04,8.59 RP2.3
  Top 0.254: Q1.3 10.62,8.57 | RP2.3 7.65,8.56
  Bottom 0.203: v38.42,7.94 38.58,8.1 38.58,8.89 35.24,12.22 17.46,12.22 v16.83,12.86 | J1.4 11.59,15.24 10.32,13.97 8.89,13.97 8.26,13.34 8.26,10.48 v9.05,9.68
D17  (via drill 0.38)
  Top 0.203: U$6.11 38.89,5.14 38.89,6.99 v39.05,7.14 | Q2.3 9.06,6.02 v8.73,6.35 8.1,6.99 RP2.1
  Bottom 0.203: v39.05,7.14 39.21,7.3 39.21,8.89 35.4,12.7 18.26,12.7 16.99,13.97 11.27,13.97 10,12.7 J1.1 10.16,12.06 10.16,9.37 8.73,7.94 v8.73,6.35
D18  (via drill 0.38)
  Top 0.203: v36.83,12.86 36.04,13.65 33.97,13.65 TX1.K | v40.48,8.57 40.8,8.26 42.53,8.26 U$6.22
  Bottom 0.203: v40.48,8.57 40.48,8.89 36.83,12.54 v36.83,12.86
GND  (via drill 0.38)
  Top 0.203: U$6.23 43.34,9.59 43.34,10 v43.5,10.16
  Top 0.254: v31.59,7.62 30.74,8.47 C19.2
  other vias: 59.05,16.51 40.96,3.65 31.11,0.95 24.92,10 36.04,9.21 29.53,10.48 30.8,5.08 61.12,7.3 53.66,7.62 53.18,12.54 60.01,12.7 48.42,8.89 49.05,3.33 48.26,5.24 36.2,15.24 5.4,5.08 23.02,15.4
  pour Top: 0,0 63.5,0 63.5,17.14 0,17.14
  pour Bottom: 0,0 63.5,0 63.5,17.14 0,17.14
  pour Route15: 0,17.14 0,0 62.87,0 62.87,17.14
N$1
  Top 0.406: IC1.3 51.44,10.79 52.07,11.43 52.07,14.97 R1.1
N$2
  Top 0.254: IC2.1 5.56,4.13 6.19,4.76 9.37,4.76 9.8,4.33 S2.2
  Top 0.406: IC2.3 3.49,6.03 3.17,5.71 3.17,4.45 3.49,4.13 IC2.1
N$3
  Top 0.254: Y2.3 41.75,3.28 41.75,4.79 U$6.16
N$4
  Top 0.406: C6.2 C7.2 C8.2 49.16,6.99 IC1.6
N$5  (via drill 0.38)
  Top 0.203: Q1.4 13,8.56 v13.34,8.89 13.51,8.74 RP6.6
  Bottom 0.203: v13.34,8.89 15.88,8.89 16.14,8.62 U1.3
N$6
  Top 0.254: IC1.11 57.15,6.99 58.16,7.99 CAGND.1
N$7
  Top 0.254: IC1.10 57.15,5.71 57.78,6.35 CDEC.2
N$8
  Top 0.254: IC1.9 57.15,4.45 57.78,5.08 58.69,5.08 CDEC.1
N$9  (via drill 0.38)
  Top 0.203: Q2.1 10.18,7.32 9.84,6.99 v9.53,6.99 | 14.29,7.94 v13.34,6.99
  Top 0.254: RP6.7 14.29,7.94
  Bottom 0.203: v9.53,6.99 v13.34,6.99 15.72,6.99 16.28,6.42 U1.5
N$10  (via drill 0.38)
  Top 0.203: Q2.4 13.32,6.02 v13.34,6.03 13.75,6.03 RP6.8
  Bottom 0.254: v13.34,6.03 15.24,6.03 16.99,4.29 17.34,4.29 U1.7
N$12
  Top 0.254: IC1.16 57.52,13.34 CDC2.1
N$15
  Top 0.254: IC1.15 57.52,12.06 CFCAP.2
N$17
  Top 0.254: U$1.1 26.77,4.6 Y1.2
N$18
  Top 0.254: Y2.1 43.19,5.24 42.01,5.24 U$6.17
N$19
  Top 0.254: U$1.2 27.46,3.33 26.67,2.54 26.67,1.65 Y1.1
N$20  (via drill 0.38)
  Top 0.254: U$1.3 30.96,2.06 v31.11,1.91
  Bottom 0.254: v31.11,1.91 31.11,2.29 BAT1.PWR@1
N$22
  Top 0.254: U$6.4 34.99,6.19 R6.2
N$23
  Top 0.254: U$6.3 34.76,6.67 31.43,6.67 30.64,7.46 R2.2
N$24  (via drill 0.38)
  Top 0.254: U$6.6 36.83,6.61 36.83,7.14 36.2,7.78 v36.2,8.26 | v33.66,8.89 C19.1
  Bottom 0.254: v36.2,8.26 34.29,8.26 v33.66,8.89
N$25
  Top 0.254: U$2.P2 17.77,4.91 18.41,5.56 22.54,5.56 23.97,6.99 27.15,6.99 27.62,7.46 R2.1
N$26
  Top 0.254: U$2.P3 18.41,4.76 18.73,5.08 22.86,5.08 24.13,6.35 28.2,6.35 R6.1
N$28
  Top 0.254: TX1.A 27.64,11.76 RP1.6
N$29
  Top 0.254: RX1.A 33.97,15.56 32.38,15.56 31.75,14.92 31.75,14.13 30.96,13.34 30.16,13.34 28.42,11.59 28.43,11.45 RP1.5
N$30
  Top 0.254: PWR1.K 26.84,12.85 RP1.7
N$31
  Top 0.254: RP1.8 26.04,13.02 27.3,14.29 27.3,15.08 26.67,15.72 25.24,15.72 D2.K
N$163  (via drill 0.38)
  Top 0.203: Q1.1 11.41,10.64 v11.43,10.64 | RP6.5 13.63,9.54 v13.34,9.84
  Bottom 0.203: U1.2 13.46,9.72 v13.34,9.84 12.22,9.84 v11.43,10.64
REF
  Top 0.254: U$6.42 34.34,10.79 C22.1
RFID_CLK  (via drill 0.38)
  Top 0.254: v48.26,11.43 48.9,12.06 IC1.2 | v44.29,12.7 44.61,12.38 44.61,10 44.77,9.84 44.77,7.78 43.66,6.67 42.71,6.67 U$6.20
  Bottom 0.254: JP9.1 59.85,11.43 v48.26,11.43 46.99,12.7 v44.29,12.7
RFID_DATA  (via drill 0.38)
  Top 0.254: v53.34,9.53 IC1.13 | U$6.21 42.94,7.14 43.34,7.14 44.13,7.94 44.13,9.21 v43.97,9.37
  Bottom 0.254: JP8.1 61.12,9.53 v53.34,9.53 53.18,9.68 44.29,9.68 v43.97,9.37
RFID_EN  (via drill 0.38)
  Top 0.254: v52.7,10.64 52.86,10.79 IC1.14 | U$6.25 43.45,11.11 v43.81,11.11
  Bottom 0.254: JP7.1 61.12,11.11 60.8,10.79 52.86,10.79 v52.7,10.64 44.29,10.64 v43.81,11.11
RFID_MOD  (via drill 0.38)
  Top 0.254: JP5.1 60.01,16.19 59.05,15.24 59.05,10.64 58.58,10.16 57.63,10.16 57.15,9.68 57.15,8.73 56.67,8.26 IC1.12 | U$6.31 42.38,14.29 v42.55,14.29
  Bottom 0.254: v42.55,14.29 44.29,14.29 44.61,13.97 57.78,13.97 60.01,16.19 JP5.1
RST  (via drill 0.38)
  Top 0.203: U$6.13 39.37,5.05 39.37,6.03 v39.69,6.35 | R7.2 18.63,12.48 | 18.63,12.48 S1.P$2 15.67,11.63 J1.5 | 18.63,12.48 18.63,13.44 v18.26,13.81
  Bottom 0.203: v39.69,6.35 39.85,6.51 39.85,7.78 39.69,7.94 39.69,9.05 35.56,13.18 18.89,13.18 v18.26,13.81
SCL  (via drill 0.38)
  Top 0.203: U$1.6 v36.67,2.06 37.15,2.54 R8.2 | JP4.1 46.35,3.02 46.35,4.45 46.04,4.76 44.93,4.76 43.97,5.71 42.23,5.71 42.07,5.89 U$6.18
  Bottom 0.203: JP4.1 44.45,2.06 v36.67,2.06
SDA  (via drill 0.38)
  Top 0.203: U$1.5 v36.67,0.79 37.73,0.79 | U$6.19 42.48,6.19 44.13,6.19 44.93,5.4 v46.35,5.4
  Top 0.254: R12.2 37.73,0.79
  Bottom 0.203: v46.35,5.4 47.47,4.29 JP3.1 46.2,2.86 36.51,2.86 35.88,2.22 35.88,1.59 v36.67,0.79
VBAT
  Top 0.254: BATT.2 20.48,7.14 20,6.67 17.3,6.67 16.51,5.87 15.24,5.87 14.13,4.76 11.75,4.76 11.3,4.31 S2.1
VBUS  (via drill 0.38)
  Top 0.254: U$6.7 36.16,5.24 32.38,5.24 v31.43,4.29 31.11,3.97 26.83,3.97 25.4,2.54 17.46,2.54 17.11,2.89 U$2.P1 17.11,2.83 16.83,2.54 15.24,2.54 v13.97,3.81 | U$6.2 34.53,7.14 32.86,7.14 v32.54,7.46 | v3.81,13.97 3.81,14.61 3.02,15.4 D1.2
  Bottom 0.254: v32.54,7.46 31.91,6.83 31.91,4.76 v31.43,4.29 | v13.97,3.81 8.26,3.81 6.99,5.08 6.99,10.79 v3.81,13.97
VCC  (via drill 0.38)
  Top 0.203: U$6.34
  Top 0.254: RP1.3 RP1.4 v29.37,8.89 29.37,9.05 30.16,9.84 33.88,9.84 U$6.44 | v41.27,0.95 R12.1 R8.1 39.59,3.23 40.48,4.13 40.48,4.65 U$6.14 | RP2.6 RP2.7 RP2.8 | RP2.6 RP2.5 | 2.22,7.3 | IC2.5 | R7.1 19.84,15.4 v19.68,15.56 | RP2.6 5.97,10.26 v6.03,10.32 | D3.1 v6.99,13.18 | D1.1 v6.99,15.4
  Top 0.305: U$1.8 32.86,4.6 v32.54,4.29 | U$6.34 39.85,10.95 v39.85,10.64 40.16,10.64 41.75,9.05 42.09,9.05 U$6.24 | 38.1,12.7 U$6.34
  Top 0.406: C5.1 57.78,3.81 57.15,3.17 53.34,3.17 52.07,4.45 52.07,5.71 | 52.07,5.71 v52.7,6.35 52.7,8.89 52.07,9.53 IC1.4 | IC1.7 52.07,5.71 | IC3.1 2.23,9.21 2.54,8.89 2.54,8.26 | 2.54,8.26 2.54,7.62 | 2.54,7.62 2.22,7.3 2.54,6.99 | IC2.5 1.56,3.47 C21.1 | IC3.3 2.22,7.3 | 2.54,6.99 2.54,4.45 2.22,4.13 IC2.5 | 2.54,6.99 2.54,7.62 | 2.54,8.26 v2.86,8.26
  pour Route2: 0,17.14 62.87,17.14 62.87,0 0,0

### Text on the board
tPlace: MAKER | PULSE | 8R2 | RESET | S | 1n | 10n | Z | TX | RX | 1n | 10n | D13 | PWR | 100n | 1u | 1u | 1n | 100n | 3 | 1n | 100n | 5 | 1n | 100n | 1u
bPlace: kevin | asher | baker | glick | makerpulse.com | BATT-6VMAX | V2-04/21/2013 | AVRFID | MOD/D5 | CLK/RX | - | EN/D4 | DATA/TX | + | 5V | SDA | D10 | GND | SCL | GND | LED-D9 | GND | SPK-D6